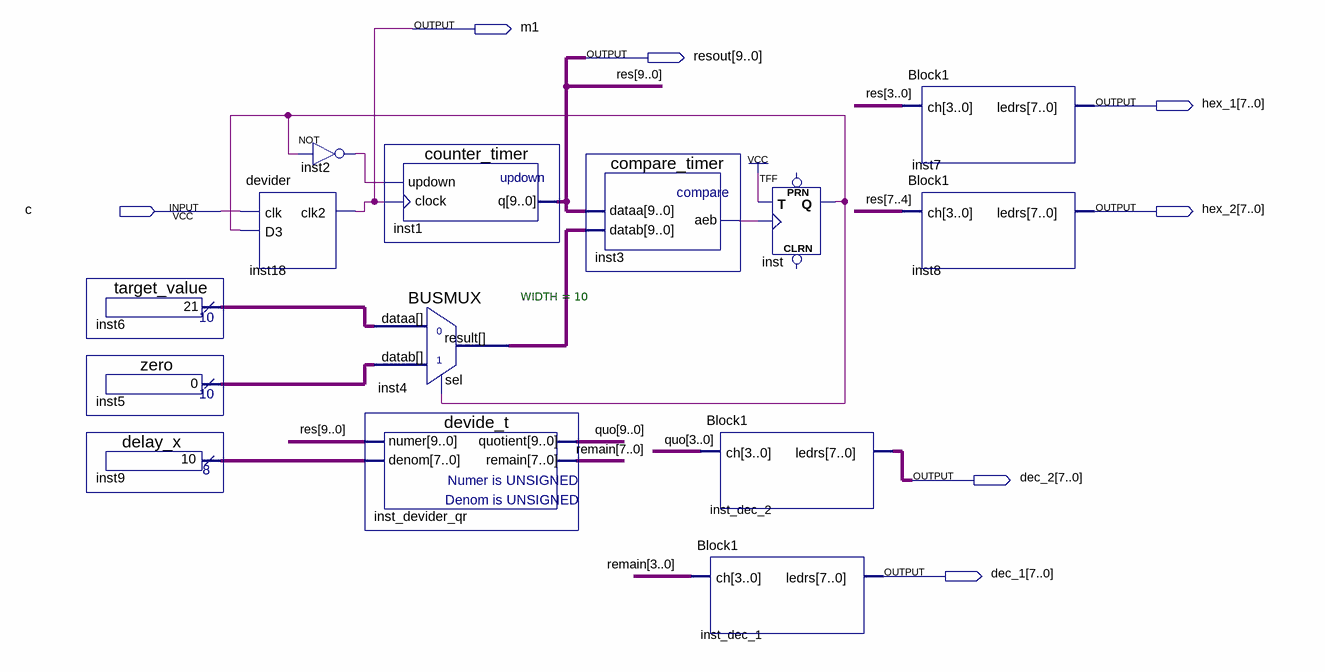
[diagram p0: schematic sheet]
// Quartus schematic prod.bdf as structural Verilog: 14 symbols, 7 pins
module prod (
  input  c,
  output m1,
  output [9:0] resout,
  output [7:0] hex_1,
  output [7:0] hex_2,
  output [7:0] dec_2,
  output [7:0] dec_1
);

  wire inst2_out, inst3_aeb, inst_q;
  wire [7:0] inst9_result, remain;
  wire [9:0] inst4_result, inst5_result, inst6_result, quo;

  target_value inst6 (.result(inst6_result));
  zero inst5 (.result(inst5_result));
  delay_x inst9 (.result(inst9_result));
  not inst2 (inst2_out, inst_q);
  devider inst18 (.clk(c), .D3(inst_q), .clk2(m1));
  counter_timer inst1 (.updown(inst2_out), .clock(m1), .q(resout));
  BUSMUX #(.WIDTH(10)) inst4 (.datab(inst5_result), .sel(inst_q), .dataa(inst6_result), .result(inst4_result));
  devide_t inst_devider_qr (.numer(resout), .denom(inst9_result), .quotient(quo), .remain(remain));
  compare_timer inst3 (.dataa(resout), .datab(inst4_result), .aeb(inst3_aeb));
  Block1 inst_dec_1 (.ch(remain[3:0]), .ledrs(dec_1));
  TFF inst (.T(1'b1), .CLK(inst3_aeb), .Q(inst_q));  // open: PRN, CLRN
  Block1 inst_dec_2 (.ch(quo[3:0]), .ledrs(dec_2));
  Block1 inst7 (.ch(resout[3:0]), .ledrs(hex_1));
  Block1 inst8 (.ch(resout[7:4]), .ledrs(hex_2));

  // Other names for the same wires on the sheet: res[9:0] = resout
endmodule
